# Altium schematic sheet JTAG.SchDoc: CONTROLADORA AIRPOPCORN
size A3; DocumentNumber: 13; SheetNumber: 13; SheetTotal: 15
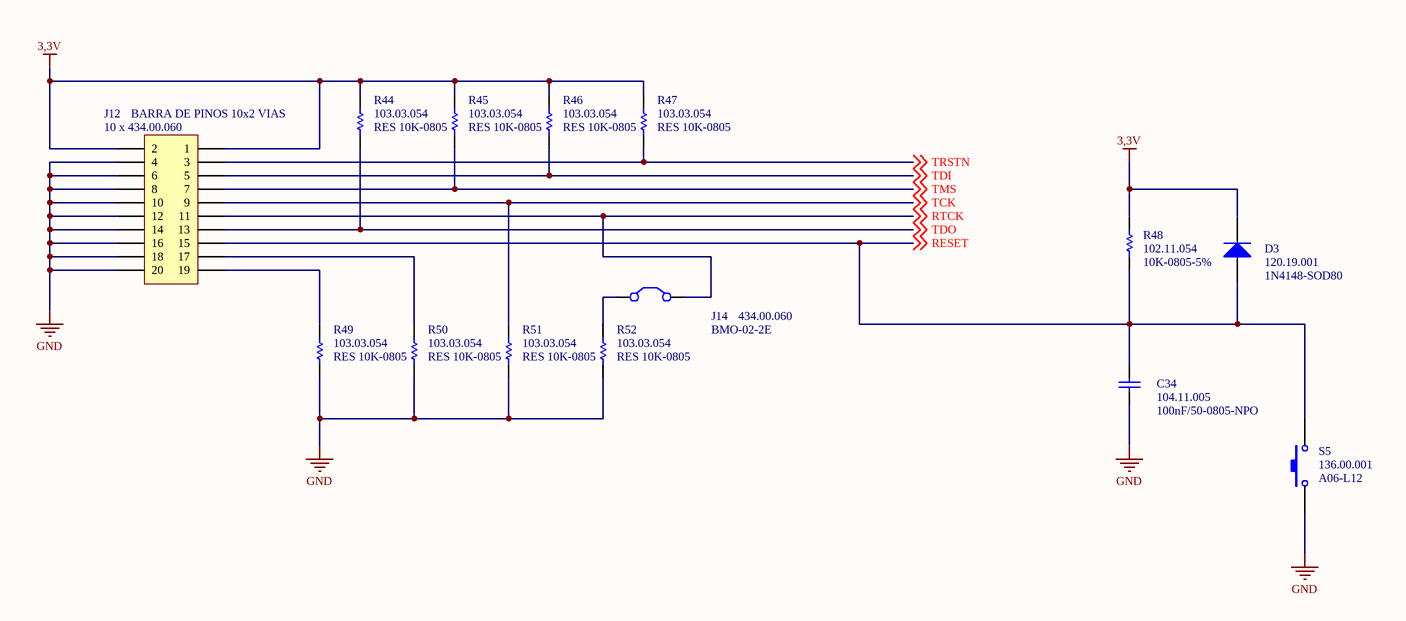
[diagram p0: JTAG.SchDoc]

## Parts
C34  100nF/50-0805-NPO  ERP: 104.11.005  [0805-REVISADO ONDA]
D3  1N4148-SOD80  ERP: 120.19.001  [MINIMLEF/SOD80 - REVISADO ONDA]
J12  BARRA DE PINOS 10x2 VIAS  ERP: 10 x 434.00.060  [IDCSC-20]
J14  BMO-02-2E  ERP: 434.00.060  [JUMPER100]
R44  RES 10K-0805  ERP: 103.03.054  [0805-REVISADO ONDA]
R45  RES 10K-0805  ERP: 103.03.054  [0805-REVISADO ONDA]
R46  RES 10K-0805  ERP: 103.03.054  [0805-REVISADO ONDA]
R47  RES 10K-0805  ERP: 103.03.054  [0805-REVISADO ONDA]
R48  10K-0805-5%  ERP: 102.11.054  [0805-REVISADO ONDA]
R49  RES 10K-0805  ERP: 103.03.054  [0805-REVISADO ONDA]
R50  RES 10K-0805  ERP: 103.03.054  [0805-REVISADO ONDA]
R51  RES 10K-0805  ERP: 103.03.054  [0805-REVISADO ONDA]
R52  RES 10K-0805  ERP: 103.03.054  [0805-REVISADO ONDA]
S5  A06-L12  ERP: 136.00.001  [chave tactil nova]

## Nets
3,3V: D3.2 J12.1 J12.2 R44.1 R45.1 R46.1 R47.1 R48.2
GND: C34.1 J12.4 J12.6 J12.8 J12.10 J12.12 J12.14 J12.16 J12.18 J12.20 R49.2 R50.2 R51.2 R52.2 S5.1
RESET: C34.2 D3.1 J12.15 R48.1 S5.2 ; off-sheet RESET
RTCK: J12.11 J14.2(C2) ; off-sheet RTCK
TCK: J12.9 R51.1 ; off-sheet TCK
TDI: J12.5 R46.2 ; off-sheet TDI
TDO: J12.13 R44.2 ; off-sheet TDO
TMS: J12.7 R45.2 ; off-sheet TMS
TRSTN: J12.3 R47.2 ; off-sheet TRSTN
NetJ12_17: J12.17 R50.1
NetJ12_19: J12.19 R49.1
NetJ14_1: J14.1(C1) R52.1

## Notes on the sheet
- NOME
- DATA
- PROJETO
- DESCRIÇÃO
- desenho
- verif.
- aprov.
- TAMANHO
- CODIGO
- Todas as informações disponíveis
- não devem ser divulgadas,
- em parte ou todo.
- CIRCUITO IMPRESSO
- MONTAGEM ELETRÔNICA
- A4
- de

## Library data of the parts
J12 = HEADER 10x2
J14 = BARRA DE PINOS